# Altium schematic sheet POWER_SCH.SchDoc
size 431 x 279 mm
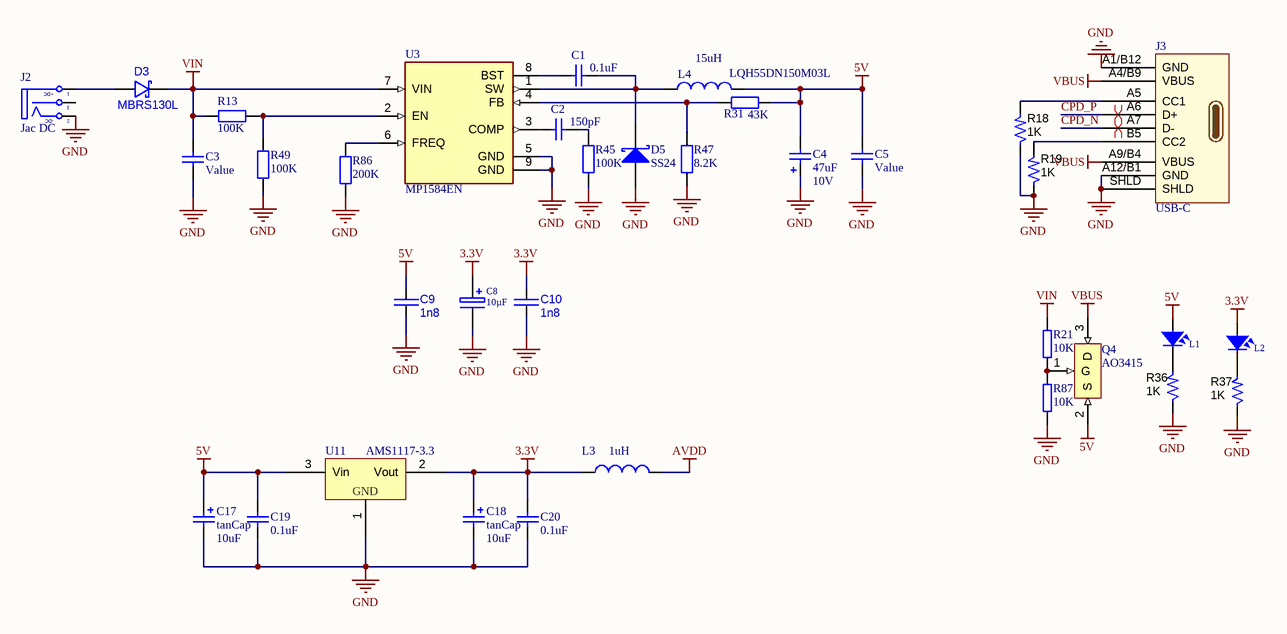
[diagram p0: POWER_SCH.SchDoc]

## Parts
C1  0.1uF  [CAP-0603]
C2  150pF  [CAP-0603]
C3  Value  [C1206]
C4  47uF  Voltage: 10V  [Tantal_B]
C5  Value  [C1206]
C8  CAP  [CAPMP3528X210N]  (value not drawn)
C9  value 1n8  [CAPC2012X135N]  (hidden comment: approved sub OK)
C10  value 1n8  [CAPC2012X135N]  (hidden comment: approved sub OK)
C17  tanCap  value 10uF  [C1206]
C18  tanCap  value 10uF  [C1206]
C19  value 0.1uF  [C0805]  (hidden comment: Cap)
C20  value 0.1uF  [C0805]  (hidden comment: Cap)
D3  MBRS130L  [DO-214AA]
D5  SS24  [SMB]
J2  Jac DC  [DC-IN]
J3  USB-C  [USB-C 8p]
L1  LED SMD  [SM-LED-0805-Orange]  (value not drawn)
L2  LED SMD  [SM-LED-0805-Orange]  (value not drawn)
L3  value 1uH  [C0805]  (hidden comment: Inductor)
L4  15uH  Marka: LQH55DN150M03L  [Inductor SMD 6.8*6.8*4.5]
Q4  AO3415  [SOT23-3]
R13  100K  [RES-0603]
R18  1K  [RESC1608N_ZERO]
R19  1K  [RESC1608N_ZERO]
R21  value 10K  [RESC1608N_ZERO]  (hidden comment: Resistor)
R31  43K  [RES-0603]
R36  1K  [RESC1608N_ZERO]
R37  1K  [RESC1608N_ZERO]
R45  100K  [RES-0603]
R47  8.2K  [RES-0603]
R49  100K  [RES-0603]
R86  200K  [RES-0603]
R87  value 10K  [RESC1608N_ZERO]  (hidden comment: Resistor)
U3  MP1584EN  [SOIC127P600X170-9N]
U11  AMS1117-3.3  [SOT223_M]

## Nets
3.3V: C8.1 C10.2 C18.1 C20.1 L2.1 L3.1 U11.2(Vout)
5V: C4.2 C5.2 C9.2 C17.1 C19.1 L1.1 L4.2 Q4.2(S) R31.2 U11.3(Vin)
AVDD: L3.2
GND: C3.1 C4.1 C5.1 C8.2 C9.1 C10.1 C17.2 C18.2 C19.2 C20.2 D5.1(A) J2.2(TN) J3.A1/B12(GND) J3.A12/B1(GND) J3.SHLD R18.1 R19.1 R36.1 R37.1 R45.2 R47.2 R49.1 R86.1 R87.2 U3.5(GND) U3.9(GND) U11.1(GND)
VBUS: J3.A4/B9(VBUS) J3.A9/B4(VBUS) Q4.3(D)
VIN: C3.2 D3.K R13.1 R21.1 U3.7(VIN)
CPD_N: J3.A7(D-)
CPD_P: J3.A6(D+)
NetC1_1: C1.1 U3.8(BST)
NetC1_2: C1.2 D5.2(K) L4.1 U3.1(SW)
NetC2_1: C2.1 U3.3(COMP)
NetC2_2: C2.2 R45.1
NetD3_A: D3.A J2.1(T)
NetJ3_A5: J3.A5(CC1) R18.2
NetJ3_B5: J3.B5(CC2) R19.2
NetL1_2: L1.2 R36.2
NetL2_2: L2.2 R37.2
NetQ4_1: Q4.1(G) R21.2 R87.1
NetR13_2: R13.2 R49.2 U3.2(EN)
NetR31_1: R31.1 R47.1 U3.4(FB)
NetR86_2: R86.2 U3.6(FREQ)

Not connected (* = marked no-connect by the designer): J2 3(S)

## Layout directives
differential pair: CPD_N, CPD_P

## Notes on the sheet
- DWG. NO.
- REV.
- SHT.
- THIS DOCUMENT AND THE DATA DISCLOSED HEREIN OR HEREWITH IS THE PROPERTY OF ALTIUM LIMITED AND MAY BE FREELY DISTRIBUTED IN WHOLE. NO RIGHTS ARE RESERVED OR EXPRESS OR IMPLIED WARANTEE GIVEN.
- REVISION
- DESCRIPTION
- DATE
- APPROVED
- ENG:
- APPROVALS
- PROJECT
- DSN:
- CHK:
- REFERENCE DOCUMENTS
- PROJECT REVISION:
- TITLE
- DOCUMENT REVISION:
- DESIGN ITEM:
- BOM:
- FAB DWG:
- PCB DWG:
- ASSY DWG:
- SCALE:
- SIZE
- B
- CAGE CODE
- FILE NAME
- DWG NO.
- SHEET
- OF
- REV
- (in symbol CAP Tatalium) 10µF
- (in symbol DCIN) +DC; -DC

## Library data of the parts
C1 C2 C19 C20 = Cap: Capacitor; Published: 8-Jun-2000; LatestRevisionDate: 17-Jul-2002; LatestRevisionNote: Re-released for DXP Platform.; PackageReference: RAD-0.3; Publisher: Altium Limited; PackageDescription: Radial Cap, Thru-Hole; 2 Leads; 0.3 in Pin Spacing
  C1 C2: price: price; links: links
C3 C5 = Cap SMD 1206
C4 = Cap Pol: Polarized Capacitor (Axial); Published: 8-Jun-2000; LatestRevisionDate: 17-Jul-2002; LatestRevisionNote: Re-released for DXP Platform.; PackageReference: POLAR0.8; Publisher: Altium Limited; PackageDescription: Polarized Capacitor; 2 Leads; links: https://www.promelec.ru/product/327656/; price: 12.53
C8 = CAP Tatalium
C9 C10 = CAP C_0805: Capacitor SMD Cer 1.8nF 10% 50V X7R 0805; Manufacturer 1: AVX Corporation; Manufacturer Part Number 1: 08055C182KAT2A; Ratings: 50V; X7R; SCDType: source*; Tolerance: ±10%; Operating Temperature: -55°C ~ 125°C; Package / Case: 0805 (2012 metric); Supplier 1: Digi-Key; Supplier Part Number 1: 478-1374-1-ND
C17 C18 = Cap Pol2: Polarized Capacitor (Axial); Published: 8-Jun-2000; LatestRevisionDate: 17-Jul-2002; LatestRevisionNote: Re-released for DXP Platform.; PackageReference: POLAR0.8; Publisher: Altium Limited; PackageDescription: Polarized Capacitor; 2 Leads
D3 = DIODE_SCHOTTKY_MBRS130L: Diode Schottky SMD 30V 2A DO-214AA; Manufacturer 1: Fairchild Semiconductor; Material: Si; Ratings: 30Vr; 2A; SCDType: source; Package / Case: DO-214AA, SMB; Supplier 1: Digi-Key; Supplier Part Number 1: MBRS130LFSCT-ND; Manufacturer Part Number 1: MBRS130L
D5 = D Schottky: Schottky Diode; Published: 8-Jun-2000; LatestRevisionDate: 17-Jul-2002; LatestRevisionNote: Re-released for DXP Platform.; PackageReference: SMB; Publisher: Altium Limited; PackageDescription: DO-214-AA/SMB; 2 C-Bend Leads; Body 5.3 x 3.6 mm, inc. leads (LxW); Code_JEDEC: DO-214-AA
J2 = DCIN: Jac DC input; Value: Jac DC
L1 L2 = LED SMD 0805
L3 = Inductor: Code_IEC: 1005; Published: 8-Jun-2000; LatestRevisionDate: 29-May-2009; LatestRevisionNote: IPC-7351 Footprint Added.; PackageReference: 0402-A; Publisher: Altium Limited; PackageDescription: Chip Inductor; Code_JEITA: 0402
L4 = Inductor: price: 68.07; links: https://www.promelec.ru/product/318749/
R13 R31 R45 R47 R49 R86 = Res: price: price; links: links
R18 R19 R36 R37 = RES_0603: Resistor SMD chip 0.0 Ohm 0.1W 0603; Manufacturer 1: Vishay/Dale; Manufacturer Part Number 1: CRCW06030000Z0EA; Tolerance: ±5%; Ratings: 1/10W; SCDType: spec; Package / Case: 0603 (1608metric); Supplier 1: Digi-Key; Supplier Part Number 1: 541-0.0GCT-ND; ComponentLink1URL: http://www.vishay.com/doc?20035; ComponentLink1Description: http://www.vishay.com/doc?20035; Supplier 2: Digi-Key; Supplier Part Number 2: P0.0GTR-ND; Manufacturer 2: Panasonic Electronic Components; Manufacturer Part Number 2: ERJ-3GEY0R00V; RoHS 2: RoHS Compliant; ComponentLink2URL: http://industrial.panasonic.com/www-cgi/jvcr13pz.cgi?E+PZ+3+AOA0001+ERJ3GEY0R00V+7+WW; ComponentLink2Description: http://industrial.panasonic.com/www-cgi/jvcr13pz.cgi?E+PZ+3+AOA0001+ERJ3GEY0R00V+7+WW; Supplier 3: Digi-Key; Supplier Part Number 3: 311-0.0LECT-ND; Manufacturer 3: Yageo; Manufacturer Part Number 3: AC0603JR-070RL; RoHS 3: RoHS Compliant; ComponentLink3URL: http://www.yageo.com/documents/recent/PYu-AC_51_RoHS_L_2.pdf; ComponentLink3Description: http://www.yageo.com/documents/recent/PYu-AC_51_RoHS_L_2.pdf
R21 R87 = RES-SM-0603-10K: RES SM 0603 10K; Supplier 1: Farnell; Supplier 2: Digi-Key; Supplier Part Number 1: 9330399; Supplier Part Number 2: 541-10.0KHCT-ND
U3 = MP1584EN: Buck Switching Regulator IC Positive Adjustable 0.8V 1 Output 3A 8-SOIC _0.154, 3.90mm Width_ Exposed Pad; MF: Monolithic Power; MP: MP1584EN; Value: *; Package: SOIC-8 Monolithic Power; SnapEDA_Link: https://www.snapeda.com/parts/MP1584EN/Monolithic%20Power%20Systems%20Inc./view-part/891721/?ref=snap; Price: None; Availability: Unavailable
U11 = AMS1117: AMS1117-